# EAGLE schematic mycodo board 2.0 (EAGLE 9.6.2)
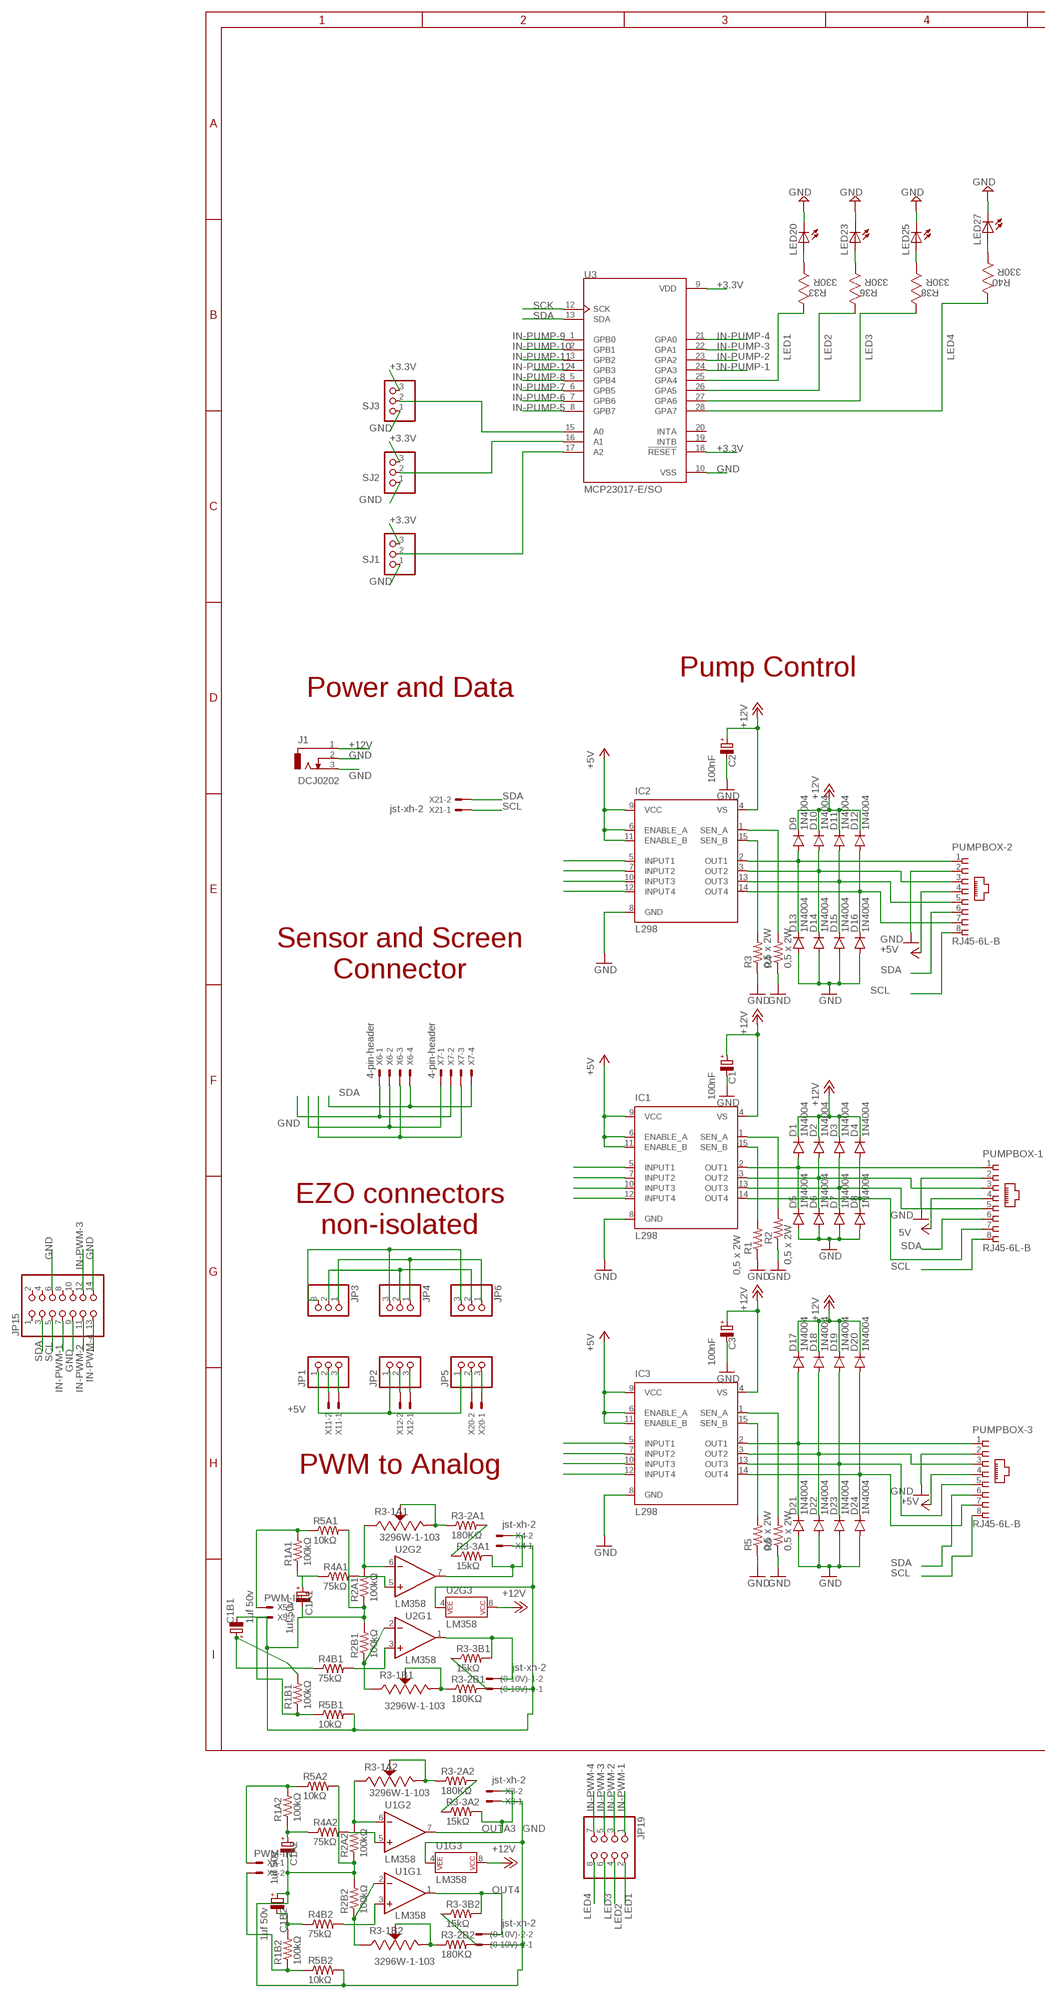
[diagram p0: schematic, sheet 1, part 1 of 2]
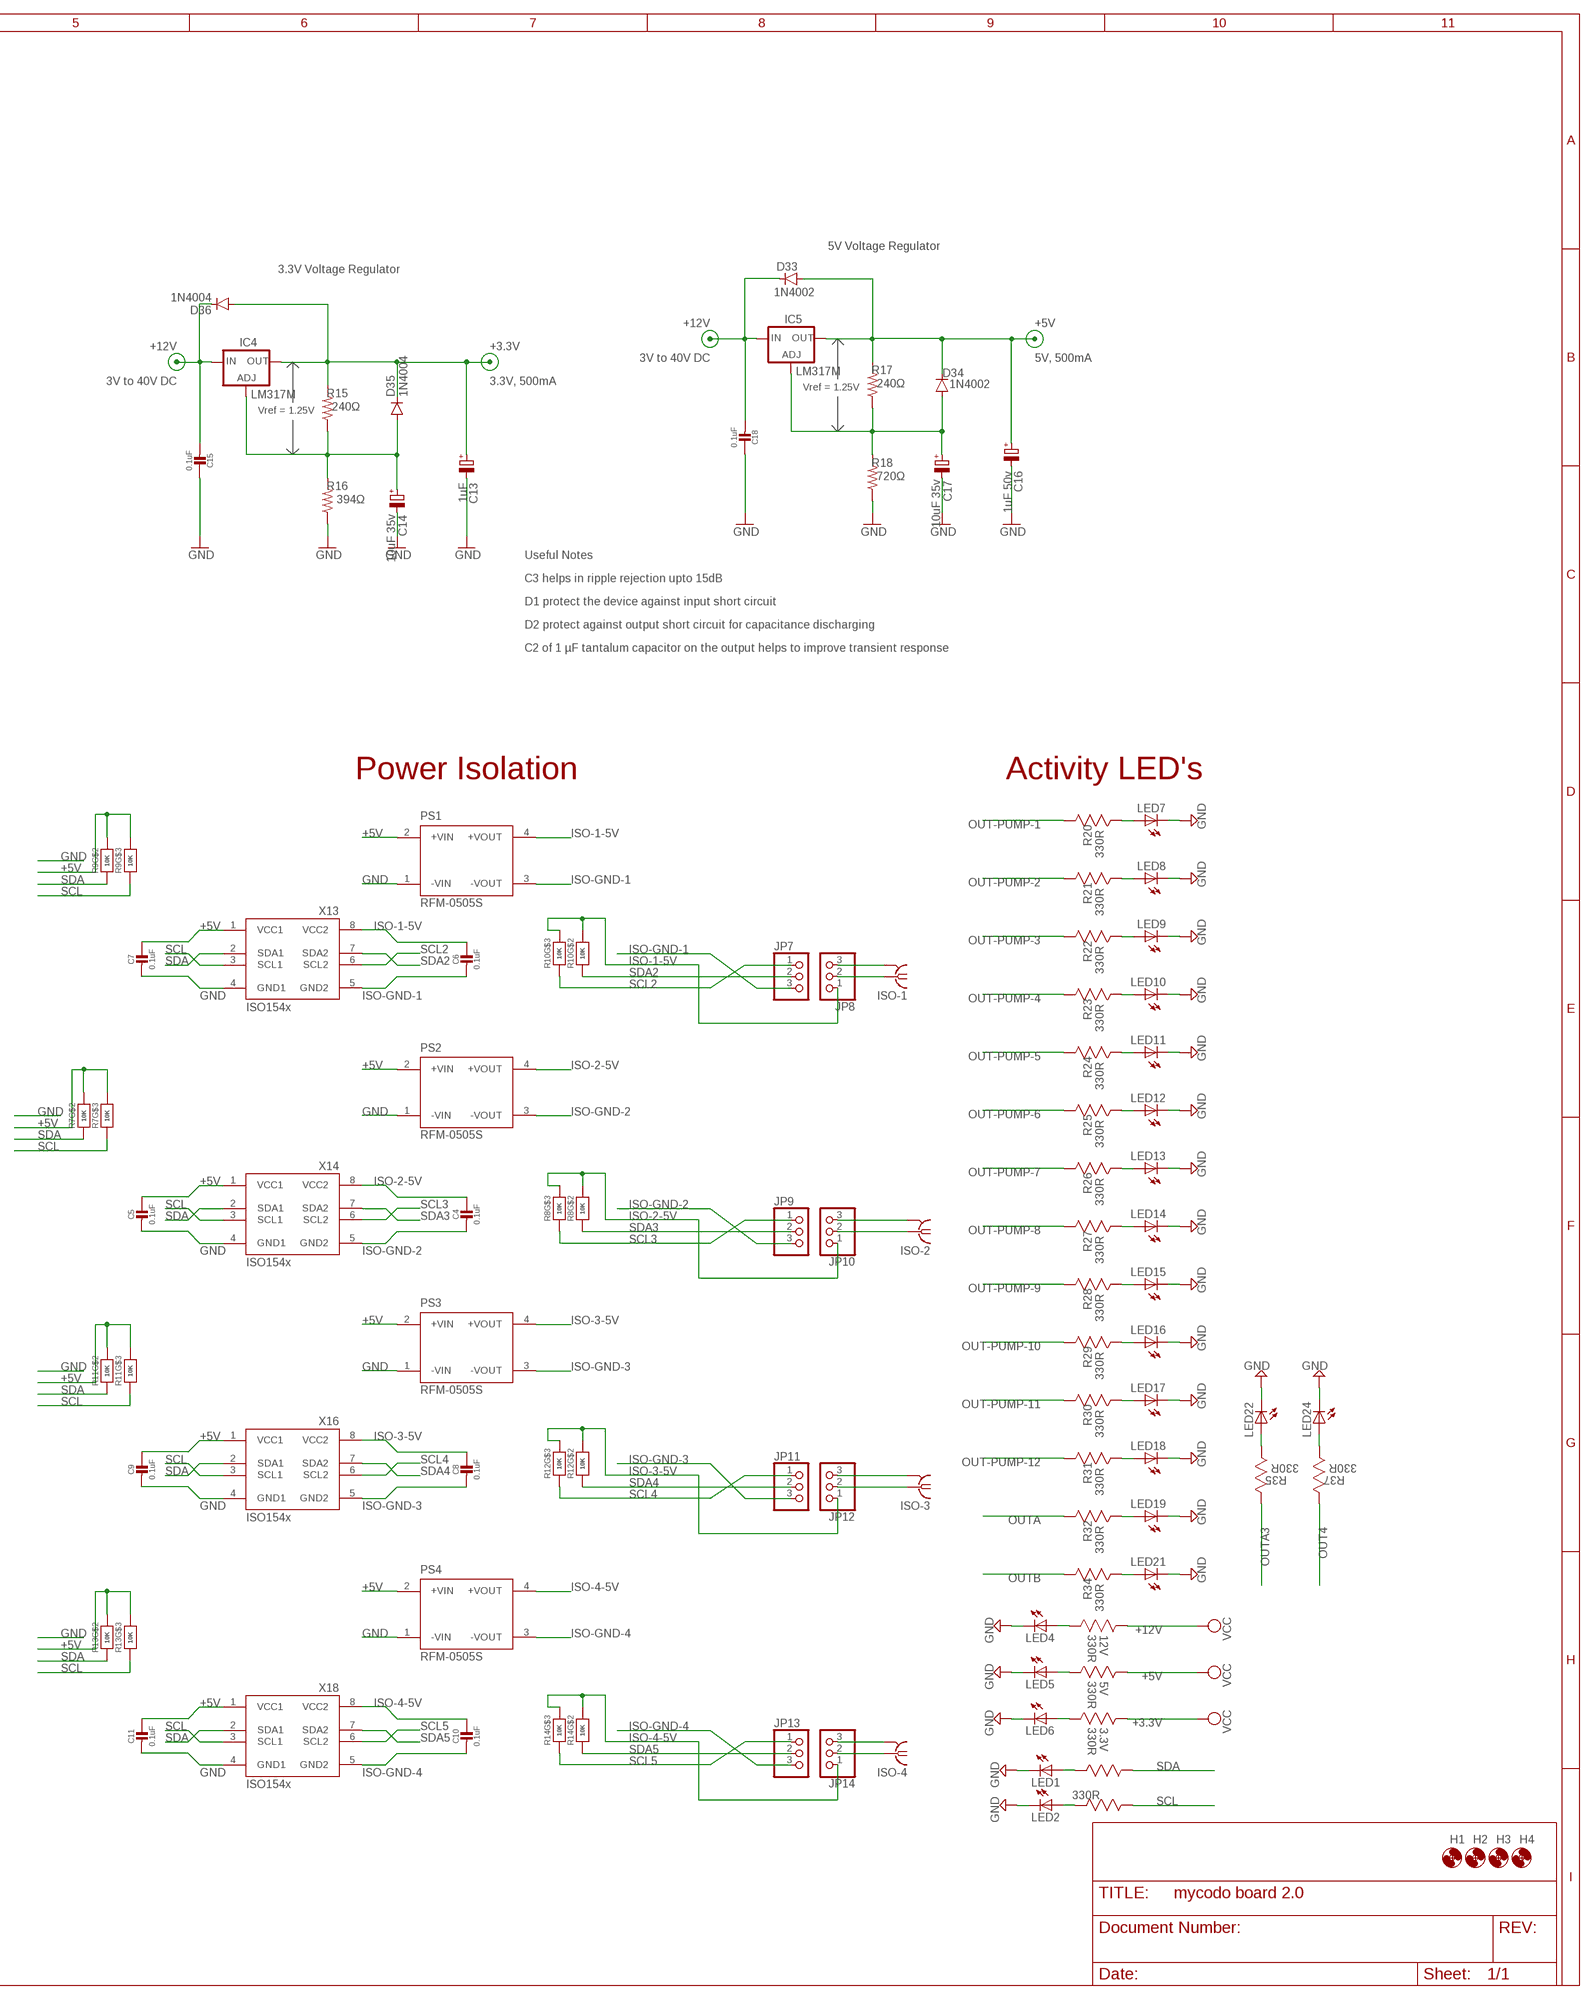
[diagram p1: schematic, sheet 1, part 2 of 2]

## Parts
3.3V  330R  MC0.063W06031%330R  [RESC1608X60N]
5V  330R  MC0.063W06031%330R  [RESC1608X60N]
12V  330R  MC0.063W06031%330R  [RESC1608X60N]
(0-10V)-1  jst-xh-2  JST-XH-02-PIN-LONG-PAD  [JST-XH-02-PACKAGE-LONG-PAD]
(0-10V)-2  jst-xh-2  JST-XH-02-PIN-LONG-PAD  [JST-XH-02-PACKAGE-LONG-PAD]
C1  100nF  1U/50V  [E1,5-4]
C1A1  1uf 50v  1U/50V  [E1,5-4]
C1A2  1uf 50v  1U/50V  [E1,5-4]
C1B1  1uf 50v  1U/50V  [E1,5-4]
C1B2  1uf 50v  1U/50V  [E1,5-4]
C2  100nF  1U/50V  [E1,5-4]
C3  100nF  1U/50V  [E1,5-4]
C4  0.1uF  CAP_CERAMIC0603_NO  [0603-NO]
C5  0.1uF  CAP_CERAMIC0603_NO  [0603-NO]
C6  0.1uF  CAP_CERAMIC0603_NO  [0603-NO]
C7  0.1uF  CAP_CERAMIC0603_NO  [0603-NO]
C8  0.1uF  CAP_CERAMIC0603_NO  [0603-NO]
C9  0.1uF  CAP_CERAMIC0603_NO  [0603-NO]
C10  0.1uF  CAP_CERAMIC0603_NO  [0603-NO]
C11  0.1uF  CAP_CERAMIC0603_NO  [0603-NO]
C13  1uF  1U/50V  [E1,5-4]
C14  10uF 35v  1U/50V  [E1,5-4]
C15  0.1uF  CAP_CERAMIC0603_NO  [0603-NO]
C16  1uF 50v  1U/50V  [E1,5-4]
C17  10uF 35v  1U/50V  [E1,5-4]
C18  0.1uF  CAP_CERAMIC0603_NO  [0603-NO]
D1  1N4004  DIODE-DO214BA  [DO214BA]
D2  1N4004  DIODE-DO214BA  [DO214BA]
D3  1N4004  DIODE-DO214BA  [DO214BA]
D4  1N4004  DIODE-DO214BA  [DO214BA]
D5  1N4004  DIODE-DO214BA  [DO214BA]
D6  1N4004  DIODE-DO214BA  [DO214BA]
D7  1N4004  DIODE-DO214BA  [DO214BA]
D8  1N4004  DIODE-DO214BA  [DO214BA]
D9  1N4004  DIODE-DO214BA  [DO214BA]
D10  1N4004  DIODE-DO214BA  [DO214BA]
D11  1N4004  DIODE-DO214BA  [DO214BA]
D12  1N4004  DIODE-DO214BA  [DO214BA]
D13  1N4004  DIODE-DO214BA  [DO214BA]
D14  1N4004  DIODE-DO214BA  [DO214BA]
D15  1N4004  DIODE-DO214BA  [DO214BA]
D16  1N4004  DIODE-DO214BA  [DO214BA]
D17  1N4004  DIODE-DO214BA  [DO214BA]
D18  1N4004  DIODE-DO214BA  [DO214BA]
D19  1N4004  DIODE-DO214BA  [DO214BA]
D20  1N4004  DIODE-DO214BA  [DO214BA]
D21  1N4004  DIODE-DO214BA  [DO214BA]
D22  1N4004  DIODE-DO214BA  [DO214BA]
D23  1N4004  DIODE-DO214BA  [DO214BA]
D24  1N4004  DIODE-DO214BA  [DO214BA]
D33  1N4002  DIODE-DO214BA  [DO214BA]
D34  1N4002  DIODE-DO214BA  [DO214BA]
D35  1N4004  DIODE-DO214BA  [DO214BA]
D36  1N4004  DIODE-DO214BA  [DO214BA]
H1  MOUNT-HOLE3.0  [3,0]
H2  MOUNT-HOLE3.0  [3,0]
H3  MOUNT-HOLE3.0  [3,0]
H4  MOUNT-HOLE3.0  [3,0]
IC1  L298  [MULTIWATT-15]
IC2  L298  [MULTIWATT-15]
IC3  L298  [MULTIWATT-15]
IC4  LM317MBSTT3  [SOT223]
IC5  LM317MBSTT3  [SOT223]
ISO-1  SMA Plug  SMA-142-0701-801/806  [J502-ND-142-0701-801/806]
ISO-2  SMA Plug  SMA-142-0701-801/806  [J502-ND-142-0701-801/806]
ISO-3  SMA Plug  SMA-142-0701-801/806  [J502-ND-142-0701-801/806]
ISO-4  SMA Plug  SMA-142-0701-801/806  [J502-ND-142-0701-801/806]
J1  DCJ0202  [DCJ0202]
JP1  PINHD-1X3CB  [1X03-CLEANBIG]
JP2  PINHD-1X3CB  [1X03-CLEANBIG]
JP3  PINHD-1X3CB  [1X03-CLEANBIG]
JP4  PINHD-1X3CB  [1X03-CLEANBIG]
JP5  PINHD-1X3CB  [1X03-CLEANBIG]
JP6  PINHD-1X3CB  [1X03-CLEANBIG]
JP7  PINHD-1X3CB  [1X03-CLEANBIG]
JP8  PINHD-1X3CB  [1X03-CLEANBIG]
JP9  PINHD-1X3CB  [1X03-CLEANBIG]
JP10  PINHD-1X3CB  [1X03-CLEANBIG]
JP11  PINHD-1X3CB  [1X03-CLEANBIG]
JP12  PINHD-1X3CB  [1X03-CLEANBIG]
JP13  PINHD-1X3CB  [1X03-CLEANBIG]
JP14  PINHD-1X3CB  [1X03-CLEANBIG]
JP15  PINHD-2X7  [2X07]
JP19  PINHD-2X4  [2X04]
LED1  LEDCHIP-LED0603  [CHIP-LED0603]
LED2  LEDCHIP-LED0603  [CHIP-LED0603]
LED4  LEDCHIP-LED0603  [CHIP-LED0603]
LED5  LEDCHIP-LED0603  [CHIP-LED0603]
LED6  LEDCHIP-LED0603  [CHIP-LED0603]
LED7  LEDCHIP-LED0603  [CHIP-LED0603]
LED8  LEDCHIP-LED0603  [CHIP-LED0603]
LED9  LEDCHIP-LED0603  [CHIP-LED0603]
LED10  LEDCHIP-LED0603  [CHIP-LED0603]
LED11  LEDCHIP-LED0603  [CHIP-LED0603]
LED12  LEDCHIP-LED0603  [CHIP-LED0603]
LED13  LEDCHIP-LED0603  [CHIP-LED0603]
LED14  LEDCHIP-LED0603  [CHIP-LED0603]
LED15  LEDCHIP-LED0603  [CHIP-LED0603]
LED16  LEDCHIP-LED0603  [CHIP-LED0603]
LED17  LEDCHIP-LED0603  [CHIP-LED0603]
LED18  LEDCHIP-LED0603  [CHIP-LED0603]
LED19  LEDCHIP-LED0603  [CHIP-LED0603]
LED20  LEDCHIP-LED0603  [CHIP-LED0603]
LED21  LEDCHIP-LED0603  [CHIP-LED0603]
LED22  LEDCHIP-LED0603  [CHIP-LED0603]
LED23  LEDCHIP-LED0603  [CHIP-LED0603]
LED24  LEDCHIP-LED0603  [CHIP-LED0603]
LED25  LEDCHIP-LED0603  [CHIP-LED0603]
LED27  LEDCHIP-LED0603  [CHIP-LED0603]
PS1  RFM-0505S  [CONV_RFM-0505S]
PS2  RFM-0505S  [CONV_RFM-0505S]
PS3  RFM-0505S  [CONV_RFM-0505S]
PS4  RFM-0505S  [CONV_RFM-0505S]
PUMPBOX-1  RJ45-6L-B  [RJ45-NO-SHIELD]
PUMPBOX-2  RJ45-6L-B  [RJ45-NO-SHIELD]
PUMPBOX-3  RJ45-6L-B  [RJ45-NO-SHIELD]
R1  0,5 x 2W  R-US_R2512  [R2512]
R1A1  100kΩ  R-US_M1206  [M1206]
R1A2  100kΩ  R-US_M1206  [M1206]
R1B1  100kΩ  R-US_M1206  [M1206]
R1B2  100kΩ  R-US_M1206  [M1206]
R2  0,5 x 2W  R-US_R2512  [R2512]
R2A1  100kΩ  R-US_M1206  [M1206]
R2A2  100kΩ  R-US_M1206  [M1206]
R2B1  100kΩ  R-US_M1206  [M1206]
R2B2  100kΩ  R-US_M1206  [M1206]
R3  0,5 x 2W  R-US_R2512  [R2512]
R3-1A1  3296W-1-103  [TRIM_3296W-1-103]
R3-1A2  3296W-1-103  [TRIM_3296W-1-103]
R3-1B1  3296W-1-103  [TRIM_3296W-1-103]
R3-1B2  3296W-1-103  [TRIM_3296W-1-103]
R3-2A1  180KΩ  R-US_M1206  [M1206]
R3-2A2  180KΩ  R-US_M1206  [M1206]
R3-2B1  180KΩ  R-US_M1206  [M1206]
R3-2B2  180KΩ  R-US_M1206  [M1206]
R3-3A1  15kΩ  R-US_M1206  [M1206]
R3-3A2  15kΩ  R-US_M1206  [M1206]
R3-3B1  15kΩ  R-US_M1206  [M1206]
R3-3B2  15kΩ  R-US_M1206  [M1206]
R4  0,5 x 2W  R-US_R2512  [R2512]
R4A1  75kΩ  R-US_M1206  [M1206]
R4A2  75kΩ  R-US_M1206  [M1206]
R4B1  75kΩ  R-US_M1206  [M1206]
R4B2  75kΩ  R-US_M1206  [M1206]
R5  0,5 x 2W  R-US_R2512  [R2512]
R5A1  10kΩ  R-US_M1206  [M1206]
R5A2  10kΩ  R-US_M1206  [M1206]
R5B1  10kΩ  R-US_M1206  [M1206]
R5B2  10kΩ  R-US_M1206  [M1206]
R6  0,5 x 2W  R-US_R2512  [R2512]
R7  10K  RESISTOR_4PACK  [RESPACK_4X0603]
R8  10K  RESISTOR_4PACK  [RESPACK_4X0603]
R9  10K  RESISTOR_4PACK  [RESPACK_4X0603]
R10  10K  RESISTOR_4PACK  [RESPACK_4X0603]
R11  10K  RESISTOR_4PACK  [RESPACK_4X0603]
R12  10K  RESISTOR_4PACK  [RESPACK_4X0603]
R13  10K  RESISTOR_4PACK  [RESPACK_4X0603]
R14  10K  RESISTOR_4PACK  [RESPACK_4X0603]
R15  240Ω  R-US_M0805  [M0805]
R16  394Ω  R-US_M0805  [M0805]
R17  240Ω  R-US_M0805  [M0805]
R18  720Ω  R-US_M0805  [M0805]
R20  330R  MC0.063W06031%330R  [RESC1608X60N]
R21  330R  MC0.063W06031%330R  [RESC1608X60N]
R22  330R  MC0.063W06031%330R  [RESC1608X60N]
R23  330R  MC0.063W06031%330R  [RESC1608X60N]
R24  330R  MC0.063W06031%330R  [RESC1608X60N]
R25  330R  MC0.063W06031%330R  [RESC1608X60N]
R26  330R  MC0.063W06031%330R  [RESC1608X60N]
R27  330R  MC0.063W06031%330R  [RESC1608X60N]
R28  330R  MC0.063W06031%330R  [RESC1608X60N]
R29  330R  MC0.063W06031%330R  [RESC1608X60N]
R30  330R  MC0.063W06031%330R  [RESC1608X60N]
R31  330R  MC0.063W06031%330R  [RESC1608X60N]
R32  330R  MC0.063W06031%330R  [RESC1608X60N]
R33  330R  MC0.063W06031%330R  [RESC1608X60N]
R34  330R  MC0.063W06031%330R  [RESC1608X60N]
R35  330R  MC0.063W06031%330R  [RESC1608X60N]
R36  330R  MC0.063W06031%330R  [RESC1608X60N]
R37  330R  MC0.063W06031%330R  [RESC1608X60N]
R38  330R  MC0.063W06031%330R  [RESC1608X60N]
R40  330R  MC0.063W06031%330R  [RESC1608X60N]
SCL  330R  MC0.063W06031%330R  [RESC1608X60N]
SDA  33R  MC0.063W06031%330R  [RESC1608X60N]
SJ1  PINHD-1X3  [1X03]
SJ2  PINHD-1X3  [1X03]
SJ3  PINHD-1X3  [1X03]
U1  LM358  [DIP08]
U2  LM358  [DIP08]
U3  MCP23017-E/SO  [SOIC127P1030X265-28N]
X3  jst-xh-2  JST-XH-02-PIN-LONG-PAD  [JST-XH-02-PACKAGE-LONG-PAD]
X4  jst-xh-2  JST-XH-02-PIN-LONG-PAD  [JST-XH-02-PACKAGE-LONG-PAD]
X5  PWM-IN  JST-XH-02-PIN-LONG-PAD  [JST-XH-02-PACKAGE-LONG-PAD]
X6  4-pin-header  JST-XH-04-PIN-LONG-PAD  [JST-XH-04-PACKAGE-LONG-PAD]
X7  4-pin-header  JST-XH-04-PIN-LONG-PAD  [JST-XH-04-PACKAGE-LONG-PAD]
X8  PWM-IN  JST-XH-02-PIN-LONG-PAD  [JST-XH-02-PACKAGE-LONG-PAD]
X11  jst-xh-2  JST-XH-02-PIN-LONG-PAD  [JST-XH-02-PACKAGE-LONG-PAD]
X12  jst-xh-2  JST-XH-02-PIN-LONG-PAD  [JST-XH-02-PACKAGE-LONG-PAD]
X13  ISO154X  [SOIC8_150MIL]
X14  ISO154X  [SOIC8_150MIL]
X16  ISO154X  [SOIC8_150MIL]
X18  ISO154X  [SOIC8_150MIL]
X20  jst-xh-2  JST-XH-02-PIN-LONG-PAD  [JST-XH-02-PACKAGE-LONG-PAD]
X21  jst-xh-2  JST-XH-02-PIN-LONG-PAD  [JST-XH-02-PACKAGE-LONG-PAD]

## Nets
+3.3V [3.3v]: 3.3V.1(R1) C13.+ D35.C D36.A IC4.4(OUT) R15.2 SJ1.3 SJ2.3 SJ3.3 U3.9(VDD) U3.18(!RESET) ; supply symbol labelled VCC
+5V [5v]: 5V.1(R1) C5.1 C7.1 C9.1 C11.1 C16.+ D33.A D34.C IC1.6(ENABLE_A) IC1.9(VCC) IC1.11(ENABLE_B) IC2.6(ENABLE_A) IC2.9(VCC) IC2.11(ENABLE_B) IC3.6(ENABLE_A) IC3.9(VCC) IC3.11(ENABLE_B) IC5.4(OUT) JP1.1 JP2.1 JP5.1 PS1.2(+VIN) PS2.2(+VIN) PS3.2(+VIN) PS4.2(+VIN) PUMPBOX-1.4 PUMPBOX-2.4 PUMPBOX-3.4 R7.6 R7.7 R9.6 R9.7 R11.6 R11.7 R13.6 R13.7 R17.2 X6.1 X7.2 X13.1(VCC1) X14.1(VCC1) X16.1(VCC1) X18.1(VCC1) ; supply symbol labelled +3V3, VCC
+12V [12v]: 12V.1(R1) C1.+ C2.+ C3.+ C15.2 C18.2 D1.C D2.C D3.C D4.C D9.C D10.C D11.C D12.C D17.C D18.C D19.C D20.C D33.C D36.C IC1.4(VS) IC2.4(VS) IC3.4(VS) IC4.3(IN) IC5.3(IN) J1.1 U1.8(P$V+) U2.8(P$V+) ; supply symbol labelled VCC
GND: (0-10V)-1.1 (0-10V)-2.1 C1.- C1A1.- C1A2.- C1B1.- C1B2.+ C2.- C3.- C5.2 C7.2 C9.2 C11.2 C13.- C14.- C15.1 C16.- C17.- C18.1 D5.A D6.A D7.A D8.A D13.A D14.A D15.A D16.A D21.A D22.A D23.A D24.A IC1.8(GND) IC2.8(GND) IC3.8(GND) J1.2 J1.3 JP3.3 JP4.3 JP6.3 JP15.6 JP15.9 JP15.14 LED1.C LED2.C LED4.C LED5.C LED6.C LED7.C LED8.C LED9.C LED10.C LED11.C LED12.C LED13.C LED14.C LED15.C LED16.C LED17.C LED18.C LED19.C LED20.C LED21.C LED22.C LED23.C LED24.C LED25.C LED27.C PS1.1(-VIN) PS2.1(-VIN) PS3.1(-VIN) PS4.1(-VIN) PUMPBOX-1.2 PUMPBOX-2.2 PUMPBOX-3.2 R1.1 R2.1 R2A1.1 R2A2.1 R2B1.2 R2B2.2 R3.1 R4.1 R5.1 R5A1.2 R5A2.2 R5B1.2 R5B2.2 R6.1 R16.1 R18.1 SJ1.1 SJ2.1 SJ3.1 U1.4(P$V-) U2.4(P$V-) U3.10(VSS) X3.1 X4.1 X6.2 X7.1 X13.4(GND1) X14.4(GND1) X16.4(GND1) X18.4(GND1)
IN-PUMP-1: IC1.5(INPUT1) U3.24(GPA3)
IN-PUMP-2: IC1.7(INPUT2) U3.23(GPA2)
IN-PUMP-3: IC1.10(INPUT3) U3.22(GPA1)
IN-PUMP-4: IC1.12(INPUT4) U3.21(GPA0)
IN-PUMP-5 [GPIO]: IC2.5(INPUT1) U3.8(GPB7)
IN-PUMP-6 [GPIO]: IC2.7(INPUT2) U3.7(GPB6)
IN-PUMP-7 [GPIO]: IC2.10(INPUT3) U3.6(GPB5)
IN-PUMP-8 [GPIO]: IC2.12(INPUT4) U3.5(GPB4)
IN-PUMP-9 [GPIO]: IC3.5(INPUT1) U3.1(GPB0)
IN-PUMP-10 [GPIO]: IC3.7(INPUT2) U3.2(GPB1)
IN-PUMP-11 [GPIO]: IC3.10(INPUT3) U3.3(GPB2)
IN-PUMP-12 [GPIO]: IC3.12(INPUT4) U3.4(GPB3)
IN-PWM-1: JP15.7 JP19.1 R1A1.2 R5A1.1 X5.1
IN-PWM-2: JP15.11 JP19.3 R1B1.1 R5B1.1 X5.2
IN-PWM-3: JP15.12 JP19.5 R1A2.2 R5A2.1 X8.1
IN-PWM-4: JP15.13 JP19.7 R1B2.1 R5B2.1 X8.2
ISO-1-5V: C6.1 JP8.1 PS1.4(+VOUT) R10.6 R10.7 X13.8(VCC2)
ISO-2-5V: C4.1 JP10.1 PS2.4(+VOUT) R8.6 R8.7 X14.8(VCC2)
ISO-3-5V: C8.1 JP12.1 PS3.4(+VOUT) R12.6 R12.7 X16.8(VCC2)
ISO-4-5V: C10.1 JP14.1 PS4.4(+VOUT) R14.6 R14.7 X18.8(VCC2)
ISO-GND-1: C6.2 JP7.3 PS1.3(-VOUT) X13.5(GND2)
ISO-GND-2: C4.2 JP9.3 PS2.3(-VOUT) X14.5(GND2)
ISO-GND-3: C8.2 JP11.3 PS3.3(-VOUT) X16.5(GND2)
ISO-GND-4: C10.2 JP13.3 PS4.3(-VOUT) X18.5(GND2)
LED1: JP19.2 R33.1(R1) U3.25(GPA4)
LED2: JP19.4 R36.1(R1) U3.26(GPA5)
LED3: JP19.6 R38.1(R1) U3.27(GPA6)
LED4: JP19.8 R40.1(R1) U3.28(GPA7)
N$1: IC2.1(SEN_A) R4.2
N$2: IC2.15(SEN_B) R3.2
N$3: IC3.1(SEN_A) R6.2
N$4: IC3.15(SEN_B) R5.2
N$5: C14.+ D35.A IC4.1(ADJ) R15.1 R16.2
N$6: R3-1B2.2(WIPER) R3-1B2.3(CW) R3-2B2.1
N$7: LED20.A R33.2(R2)
N$8: R3-2B2.2 R3-3B2.1
N$9: IC1.1(SEN_A) R2.2
N$10: IC1.15(SEN_B) R1.2
N$11: C17.+ D34.A IC5.1(ADJ) R17.1 R18.2
N$12: ISO-2.G@1 ISO-2.G@2 ISO-2.G@3 ISO-2.G@4 JP10.3
N$13: LED23.A R36.2(R2)
N$14 [GPIO]: LED1.A SDA.2(R2)
N$15: ISO-1.G@1 ISO-1.G@2 ISO-1.G@3 ISO-1.G@4 JP8.3
N$16: ISO-1.1 JP8.2
N$17: R3-1B1.2(WIPER) R3-1B1.3(CW) R3-2B1.1
N$18: R3-2B1.2 R3-3B1.1
N$19: R3-1A1.2(WIPER) R3-1A1.3(CW) R3-2A1.1
N$20: R3-2A1.2 R3-3A1.1
N$21: C1A1.+ R1A1.1 R4A1.1
N$22: C1B1.+ R1B1.2 R4B1.1
N$23: R2A1.2 R3-1A1.1(CCW) U2.6(-IN)
N$24: R2B1.1 R3-1B1.1(CCW) U2.2(-IN)
N$25: R4A1.2 U2.5(+IN)
N$26: R4B1.2 U2.3(+IN)
N$27: C1B2.- R1B2.2 R4B2.1
N$28: LED22.A R35.2(R2)
N$29: LED24.A R37.2(R2)
N$31 [GPIO]: LED2.A SCL.2(R2)
N$32: ISO-2.1 JP10.2
N$35: ISO-3.G@1 ISO-3.G@2 ISO-3.G@3 ISO-3.G@4 JP12.3
N$36: ISO-3.1 JP12.2
N$39: ISO-4.G@1 ISO-4.G@2 ISO-4.G@3 ISO-4.G@4 JP14.3
N$40: ISO-4.1 JP14.2
N$41: JP5.3 X20.1
N$42: JP5.2 X20.2
N$43: JP2.2 X12.2
N$44: JP2.3 X12.1
N$45: JP1.2 X11.2
N$46: JP1.3 X11.1
N$47: 12V.2(R2) LED4.A
N$48 [GPIO]: 5V.2(R2) LED5.A
N$49 [GPIO]: 3.3V.2(R2) LED6.A
N$50 [GPIO]: LED7.A R20.2(R2)
N$51 [GPIO]: LED8.A R21.2(R2)
N$52 [GPIO]: LED9.A R22.2(R2)
N$53 [GPIO]: LED10.A R23.2(R2)
N$54 [GPIO]: LED11.A R24.2(R2)
N$55 [GPIO]: LED12.A R25.2(R2)
N$56 [GPIO]: LED13.A R26.2(R2)
N$57 [GPIO]: LED14.A R27.2(R2)
N$58 [GPIO]: LED15.A R28.2(R2)
N$59 [GPIO]: LED16.A R29.2(R2)
N$60 [GPIO]: LED17.A R30.2(R2)
N$61 [GPIO]: LED18.A R31.2(R2)
N$62 [GPIO]: LED19.A R32.2(R2)
N$63: R3-1A2.2(WIPER) R3-1A2.3(CW) R3-2A2.1
N$64 [GPIO]: LED21.A R34.2(R2)
N$65: LED25.A R38.2(R2)
N$66: R3-2A2.2 R3-3A2.1
N$67: LED27.A R40.2(R2)
N$68: C1A2.+ R1A2.1 R4A2.1
N$70: R2A2.2 R3-1A2.1(CCW) U1.6(-IN)
N$71: R2B2.1 R3-1B2.1(CCW) U1.2(-IN)
N$72: R4A2.2 U1.5(+IN)
N$73: R4B2.2 U1.3(+IN)
N$74: SJ3.2 U3.15(A0)
N$75: SJ2.2 U3.16(A1)
N$76: SJ1.2 U3.17(A2)
OUT4: (0-10V)-2.2 R3-3B2.2 R37.1(R1) U1.1(OUT)
OUT-PUMP-1 [Pump Out]: D1.A D5.C IC1.2(OUT1) PUMPBOX-1.1 R20.1(R1)
OUT-PUMP-2 [Pump Out]: D2.A D6.C IC1.3(OUT2) PUMPBOX-1.3 R21.1(R1)
OUT-PUMP-3 [Pump Out]: D3.A D7.C IC1.13(OUT3) PUMPBOX-1.5 R22.1(R1)
OUT-PUMP-4 [Pump Out]: D4.A D8.C IC1.14(OUT4) PUMPBOX-1.7 R23.1(R1)
OUT-PUMP-5 [Pump Out]: D9.A D13.C IC2.2(OUT1) PUMPBOX-2.1 R24.1(R1)
OUT-PUMP-6 [Pump Out]: D10.A D14.C IC2.3(OUT2) PUMPBOX-2.3 R25.1(R1)
OUT-PUMP-7 [Pump Out]: D11.A D15.C IC2.13(OUT3) PUMPBOX-2.5 R26.1(R1)
OUT-PUMP-8 [Pump Out]: D12.A D16.C IC2.14(OUT4) PUMPBOX-2.7 R27.1(R1)
OUT-PUMP-9 [Pump Out]: D17.A D21.C IC3.2(OUT1) PUMPBOX-3.1 R28.1(R1)
OUT-PUMP-10 [Pump Out]: D18.A D22.C IC3.3(OUT2) PUMPBOX-3.3 R29.1(R1)
OUT-PUMP-11 [Pump Out]: D19.A D23.C IC3.13(OUT3) PUMPBOX-3.5 R30.1(R1)
OUT-PUMP-12: D20.A D24.C IC3.14(OUT4) PUMPBOX-3.7 R31.1(R1)
OUTA: R3-3A1.2 R32.1(R1) U2.7(OUT) X4.2
OUTA3: R3-3A2.2 R35.1(R1) U1.7(OUT) X3.2
OUTB: (0-10V)-1.2 R3-3B1.2 R34.1(R1) U2.1(OUT)
SCK: U3.12(SCK)
SCL: JP3.1 JP4.1 JP6.1 JP15.5 PUMPBOX-1.8 PUMPBOX-2.8 PUMPBOX-3.8 R7.3 R9.3 R11.3 R13.3 SCL.1(R1) X6.3 X7.3 X13.3(SCL1) X14.3(SCL1) X16.3(SCL1) X18.3(SCL1) X21.1
SCL2: JP7.1 R10.3 X13.6(SCL2)
SCL3: JP9.1 R8.3 X14.6(SCL2)
SCL4: JP11.1 R12.3 X16.6(SCL2)
SCL5: JP13.1 R14.3 X18.6(SCL2)
SDA: JP3.2 JP4.2 JP6.2 JP15.3 PUMPBOX-1.6 PUMPBOX-2.6 PUMPBOX-3.6 R7.2 R9.2 R11.2 R13.2 SDA.1(R1) U3.13(SDA) X6.4 X7.4 X13.2(SDA1) X14.2(SDA1) X16.2(SDA1) X18.2(SDA1) X21.2
SDA2: JP7.2 R10.2 X13.7(SDA2)
SDA3: JP9.2 R8.2 X14.7(SDA2)
SDA4: JP11.2 R12.2 X16.7(SDA2)
SDA5: JP13.2 R14.2 X18.7(SDA2)
Unconnected: JP15.1 JP15.2 JP15.4 JP15.8 JP15.10 R7.1 R7.4 R7.5 R7.8 R8.1 R8.4 R8.5 R8.8 R9.1 R9.4 R9.5 R9.8 R10.1 R10.4 R10.5 R10.8 R11.1 R11.4 R11.5 R11.8 R12.1 R12.4 R12.5 R12.8 R13.1 R13.4 R13.5 R13.8 R14.1 R14.4 R14.5 R14.8 U3.19(INTB) U3.20(INTA)

## Notes on the sheet
- 5V Voltage Regulator
- 3.3V Voltage Regulator
- 3V to 40V DC | 5V, 500mA
- 3V to 40V DC | 3.3V, 500mA
- Vref = 1.25V
- Vref = 1.25V
- Useful Notes
- C3 helps in ripple rejection upto 15dB
- D1 protect the device against input short circuit
- D2 protect against output short circuit for capacitance discharging
- C2 of 1 µF tantalum capacitor on the output helps to improve transient response
- Pump Control
- Power Isolation | Activity LED's
- Power and Data
- Sensor and Screen
  Connector
- EZO connectors
  non-isolated
- PWM to Analog

## Library data of the parts
3.3V 5V 12V R20-R38 R40 SCL SDA = Multicomp:MC0.063W06031%330R: RESISTOR, 0603; MPN: MC0.063W06031%330R; OC_FARNELL: 9331018; OC_NEWARK: -; SUPPLIER: Multicomp; TOLERANCE: ±1%; VALUE: 330 Ohms; WATTAGE: 1/16 W
(0-10V)-1 (0-10V)-2 X3-X5 X8 X11 X12 X20 X21 = Rembrandt Electronics - JST XH Connectors v1-0:JST-XH-02-PIN: JST XH Connector 2 Pin Wire to board connector. Pitch: 2,54 mm, (0.100") Number of pins: 2 Created by Rembrandt Electronics www.rembrandtelectronics.com
C1 C1A1 C1A2 C1B1 C1B2 C2 C3 C13 C14 C16 C17 = capacitors-electrolytic:?; MOUSER: 647-USW1H010MDD
C4-C11 C15 C18 = microbuilder:CAP_CERAMIC: Ceramic Capacitors For new designs, use the packages preceded by an '_' character since they are more reliable: The following footprints should be used on most boards: _0402 - Standard footprint for regular board layouts _0603 - Standard footprint for regular board layouts _0805 - Standard footprint for regular board layouts _1206 - Standard footprint for regular board layouts For extremely tight-pitch boards where space is at a premium, the following 'micro-pitch' footprints can be used (smaller pads, no silkscreen outline, etc.): _0402MP - Micro-pitch footprint for very dense/compact boards _0603MP - Micro-pitch footprint for very dense/compact boards _0805MP - Micro-pitch footprint for very dense/compact boards _1206MP - Micro-pitch footprint for very dense/compact boards
D1-D24 D33-D36 = diode:DIODE-: DIODE
H1-H4 = holes:MOUNT-HOLE: MOUNTING HOLE with drill center marker
IC1-IC3 = st-microelectronics:L298: DUAL FULL-BRIDGE DRIVER
IC4 IC5 = v-reg:LM317?*: 500 mA Adjustable Output Positive Voltage Regulator Source: http://www.onsemi.co.jp .. LM317M-D.PDF; PARTNUMBER: LM317M
ISO-1-ISO-4 = con-coax:SMA-: SMA 50 Ohm End Launch Jack Receptacle - Round Contact Johnson Components Source: www.johnsoncomponents.com .. J502-ND.pdf; MF: JOHNSON COMPONENTS; MPN: 142-0701-801; OC_FARNELL: 1608592; OC_NEWARK: 90F2624
J1 = con-jack:DCJ0202: DC POWER JACK Source: DCJ0202.pdf; OC_FARNELL: unknown; OC_NEWARK: unknown
JP1-JP14 SJ1-SJ3 = adafruit:PINHD-1X3: PIN HEADER
JP15 = pinhead:PINHD-2X7: PIN HEADER
JP19 = pinhead:PINHD-2X4: PIN HEADER
LED1 LED2 LED4-LED25 LED27 = led:LED: LED OSRAM: - CHIPLED LG R971, LG N971, LY N971, LG Q971, LY Q971, LO R971, LY R971 LH N974, LH R974 LS Q976, LO Q976, LY Q976 LO Q996 - Hyper CHIPLED LW Q18S LB Q993, LB Q99A, LB R99A - SideLED LS A670, LO A670, LY A670, LG A670, LP A670 LB A673, LV A673, LT A673, LW A673 LH A674 LY A675 LS A676, LA A676, LO A676, LY A676, LW A676 LS A679, LY A679, LG A679 - Hyper Micro SIDELED® LS Y876, LA Y876, LO Y876, LY Y876 LT Y87S - SmartLED LW L88C, LW L88S LB L89C, LB L89S, LG L890 LS L89K, LO L89K, LY L89K LS L896, LA L896, LO L896, LY L896 - TOPLED LS T670, LO T670, LY T670, LG T670, LP T670 LSG T670, LSP T670, LSY T670, LOP T670, LYG T670 LG T671, LOG T671, LSG T671 LB T673, LV T673, LT T673, LW T673 LH T674 LS T676, LA T676, LO T676, LY T676, LB T676, LH T676, LSB T676, LW T676 LB T67C, LV T67C, LT T67C, LS T67K, LO T67K, LY T67K, LW E67C LS E67B, LA E67B, LO E67B, LY E67B, LB E67C, LV E67C, LT E67C LW T67C LS T679, LY T679, LG T679 LS T770, LO T770, LY T770, LG T770, LP T770 LB T773, LV T773, LT T773, LW T773 LH T774 LS E675, LA E675, LY E675, LS T675 LS T776, LA T776, LO T776, LY T776, LB T776 LHGB T686 LT T68C, LB T68C - Hyper Mini TOPLED® LB M676 - Mini TOPLED Santana® LG M470 LS M47K, LO M47K, LY M47K Source: http://www.osram.convergy.de LUXEON: - LUMILED® LXK2-PW12-R00, LXK2-PW12-S00, LXK2-PW14-U00, LXK2-PW14-V00 LXK2-PM12-R00, LXK2-PM12-S00, LXK2-PM14-U00 LXK2-PE12-Q00, LXK2-PE12-R00, LXK2-PE12-S00, LXK2-PE14-T00, LXK2-PE14-U00 LXK2-PB12-K00, LXK2-PB12-L00, LXK2-PB12-M00, LXK2-PB14-N00, LXK2-PB14-P00, LXK2-PB14-Q00 LXK2-PR12-L00, LXK2-PR12-M00, LXK2-PR14-Q00, LXK2-PR14-R00 LXK2-PD12-Q00, LXK2-PD12-R00, LXK2-PD12-S00 LXK2-PH12-R00, LXK2-PH12-S00 LXK2-PL12-P00, LXK2-PL12-Q00, LXK2-PL12-R00 Source: www.luxeon.com KINGBRIGHT: KA-3528ASYC Source: www.kingbright.com
PS1-PS4 = RFM-0505S:RFM-0505S: DC/DC Converter, 1 Watt, SIP4, Single Output Check availability <https://pricing.snapeda.com/parts/RFM-0505S/Recom%20Power/view-part?ref=eda>; AVAILABILITY: In Stock; DESCRIPTION: 1W DC/DC-Converter 'ECONOLINE' SIP4 1kV unreg; MF: Recom Power; MP: RFM-0505S; PACKAGE: SIP-4 Recom Power; PRICE: None; PURCHASE-URL: https://pricing.snapeda.com/search/part/RFM-0505S/?ref=eda
PUMPBOX-1-PUMPBOX-3 = con-tycoelectronics:RJ45: CORCOM Modular RJ Jacks No Shield Source: www.tycoelectronics.com .. ENG_DS_1654001_1099_RJ_L_0507.pdf; MPN: RJ45-6L-B; OC_FARNELL: unknown; OC_NEWARK: 16R6090
R1 R1A1 R1A2 R1B1 R1B2 R2 R2A1 R2A2 R2B1 R2B2 R3 R3-2A1 R3-2A2 R3-2B1 R3-2B2 R3-3A1 R3-3A2 R3-3B1 R3-3B2 R4 R4A1 R4A2 R4B1 R4B2 R5 R5A1 R5A2 R5B1 R5B2 R6 = adafruit:R-US_: RESISTOR, American symbol
R3-1A1 R3-1A2 R3-1B1 R3-1B2 = 3296W-1-103:3296W-1-103: Res Cermet Trimmer 500K Ohm 10% 0.5W 25(Elec)Turn 2.19mm (9.53 X 4.83 X 11.55mm) Pin Thru-Hole Tube Check availability <https://pricing.snapeda.com/parts/3296W-1-103/Bourns/view-part?ref=eda>; AVAILABILITY: In Stock; DESCRIPTION: 10 kOhms 0.5W, 1/2W PC Pins Through Hole Trimmer Potentiometer Cermet 25.0 Turn Top Adjustment; MF: Bourns; MP: 3296W-1-103; PACKAGE: SOT-23-5 Bourns; PRICE: None; PURCHASE-URL: https://pricing.snapeda.com/search/part/3296W-1-103/?ref=eda
R7-R14 = microbuilder:RESISTOR_4PACK: Resistor Packs (4 resistors) 4 x 0603 10K 1/16W - Digikey: YC164J-10KCT-ND
R15-R18 = resistor:R-US_: RESISTOR, American symbol
U1 U2 = SparkFun-IC-Amplifiers:LM358: LM358 Jellybean op-amp Datasheet <http://www.sparkfun.com/datasheets/Components/General/LM358.pdf> SparkFun Products Op-Amp (Thru-Hole) - LM358 <https://www.sparkfun.com/products/9456> (COM-09456); PROD_ID: IC-09172
U3 = MCP23017-E_SO:MCP23017-E/SO: MCP23017 Series 5.5 V 1.7 MHz SMT 16-Bit I2C I/O Expander - SOIC-28 Check availability <https://pricing.snapeda.com/parts/MCP23017-E/SO/Microchip/view-part?ref=eda>; AVAILABILITY: In Stock; DESCRIPTION: I/O Expander 16 I²C 1.7 MHz 28-SOIC; MF: Microchip; MP: MCP23017-E/SO; PACKAGE: SOIC-28 Microchip; PRICE: None; PURCHASE-URL: https://pricing.snapeda.com/search/part/MCP23017-E/SO/?ref=eda
X6 X7 = Rembrandt Electronics - JST XH Connectors v1-0:JST-XH-04-PIN: JST XH Connector 2 Pin Wire to board connector. Pitch: 2,54 mm, (0.100") Number of pins: 4 Created by Rembrandt Electronics www.rembrandtelectronics.com
X13 X14 X16 X18 = adafruit_power:ISO154X

## Net classes
0 default: width 0.406 mm, drill 0.102 mm, clearance 0.254 mm
1 Pump Out: width 0.508 mm, drill 0.102 mm, clearance 0.254 mm
2 12v: width 0.508 mm, drill 0.102 mm, clearance 0.254 mm
3 5v: width 0.457 mm, drill 0.102 mm, clearance 0.254 mm
4 3.3v: width 0.457 mm, drill 0.102 mm, clearance 0.254 mm
5 i2c: width 0.406 mm, drill 0.102 mm, clearance 0.254 mm
6 GPIO: width 0.406 mm, drill 0.102 mm, clearance 0.254 mm
8 New Class: drill 0.102 mm, clearance 0.152 mm